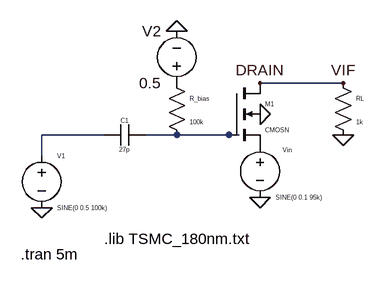
[diagram p0: schematic mixer.asc]
mixer.asc, the LTspice schematic file:
Version 4
SHEET 1 880 680
WIRE 512 112 384 112
WIRE 144 192 48 192
WIRE 256 192 208 192
WIRE 336 192 256 192
WIRE 352 192 336 192
WIRE 48 224 48 192
FLAG 48 304 0
FLAG 384 160 0
FLAG 384 288 0
FLAG 512 192 0
FLAG 512 112 VIF
FLAG 256 32 0
FLAG 384 112 DRAIN
SYMBOL voltage 48 208 R0
WINDOW 0 24 16 Left 0
WINDOW 3 24 96 Left 0
WINDOW 123 0 0 Left 0
WINDOW 39 0 0 Left 0
SYMATTR InstName V1
SYMATTR Value SINE(0 0.5 100k)
SYMBOL cap 208 176 R90
WINDOW 0 0 32 VBottom 0
WINDOW 3 32 32 VTop 0
SYMATTR InstName C1
SYMATTR Value 27p
SYMBOL res 240 96 R0
WINDOW 0 36 40 Left 0
WINDOW 3 36 76 Left 0
SYMATTR InstName R_bias
SYMATTR Value 100k
SYMBOL nmos4 336 112 R0
WINDOW 0 56 32 Left 0
WINDOW 3 56 72 Left 0
SYMATTR InstName M1
SYMATTR Value CMOSN
SYMATTR Value2 l=0.18u w=1.8u ad=0.81p as=0.81p pd=4.5u ps=4.5u
SYMBOL voltage 384 192 R0
WINDOW 0 42 30 Bottom 0
WINDOW 3 24 96 Left 0
WINDOW 123 0 0 Left 0
WINDOW 39 0 0 Left 0
SYMATTR InstName Vin
SYMATTR Value SINE(0 0.1 95k)
SYMBOL res 496 96 R0
WINDOW 0 36 40 Left 0
WINDOW 3 36 76 Left 0
SYMATTR InstName RL
SYMATTR Value 1k
SYMBOL voltage 256 128 R180
WINDOW 0 24 96 Left 2
WINDOW 3 24 16 Left 2
WINDOW 123 0 0 Left 0
WINDOW 39 0 0 Left 0
SYMATTR InstName V2
SYMATTR Value 0.5
TEXT 144 352 Left 2 !.lib TSMC_180nm.txt
TEXT 16 376 Left 2 !.tran 5m

The netlist it stands for:
* mixer.asc
V1 N001 0 SINE(0 0.5 100k)
C1 N002 N001 27p
R_bias P001 N002 100k
M1 DRAIN N002 P002 0 CMOSN l=0.18u w=1.8u ad=0.81p as=0.81p pd=4.5u ps=4.5u
Vin P002 0 SINE(0 0.1 95k)
RL DRAIN 0 1k
V2 P001 0 0.5
.model NMOS NMOS
.model PMOS PMOS
.lib standard.mos
.lib TSMC_180nm.txt
.tran 5m
.backanno
.end